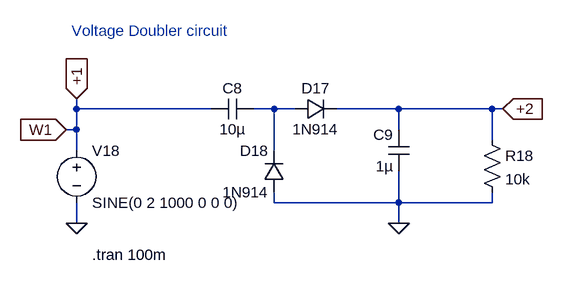
[diagram p0: schematic voltage_doubler.asc]
voltage_doubler.asc, the LTspice schematic file:
Version 4
SHEET 1 3192 728
WIRE 1648 208 1648 192
WIRE 1856 208 1648 208
WIRE 1952 208 1920 208
WIRE 1984 208 1952 208
WIRE 2144 208 2048 208
WIRE 2288 208 2144 208
WIRE 2304 208 2288 208
WIRE 1648 240 1648 208
WIRE 1648 240 1632 240
WIRE 2144 240 2144 208
WIRE 2288 256 2288 208
WIRE 1648 272 1648 240
WIRE 1952 272 1952 208
WIRE 1952 352 1952 336
WIRE 2144 352 2144 304
WIRE 2144 352 1952 352
WIRE 2288 352 2288 336
WIRE 2288 352 2144 352
WIRE 1648 384 1648 352
WIRE 2144 384 2144 352
FLAG 1648 384 0
FLAG 2144 384 0
FLAG 2304 208 +2
IOPIN 2304 208 In
FLAG 1648 192 +1
IOPIN 1648 192 In
FLAG 1632 240 W1
IOPIN 1632 240 In
SYMBOL cap 1920 192 R90
WINDOW 0 0 32 VBottom 2
WINDOW 3 32 32 VTop 2
SYMATTR InstName C8
SYMATTR Value 10µ
SYMBOL cap 2160 304 R180
WINDOW 0 24 56 Left 2
WINDOW 3 24 8 Left 2
SYMATTR InstName C9
SYMATTR Value 1µ
SYMBOL diode 1984 224 R270
WINDOW 0 32 32 VTop 2
WINDOW 3 0 32 VBottom 2
SYMATTR InstName D17
SYMATTR Value 1N914
SYMBOL diode 1968 336 R180
WINDOW 0 24 64 Left 2
WINDOW 3 24 0 Left 2
SYMATTR InstName D18
SYMATTR Value 1N914
SYMBOL res 2272 240 R0
SYMATTR InstName R18
SYMATTR Value 10k
SYMBOL voltage 1648 256 R0
WINDOW 123 0 0 Left 0
WINDOW 39 0 0 Left 0
SYMATTR InstName V18
SYMATTR Value SINE(0 2 1000 0 0 0)
TEXT 1672 432 Left 2 !.tran 100m
TEXT 1640 88 Left 2 ;Voltage Doubler circuit

The netlist it stands for:
* voltage_doubler.asc
C8 N001 W1 10µ
C9 0 +2 1µ
D17 N001 +2 1N914
D18 0 N001 1N914
R18 +2 0 10k
V18 W1 0 SINE(0 2 1000 0 0 0)
.model D D
.lib standard.dio
.tran 100m
* Voltage Doubler circuit
.backanno
.end